# Altium schematic sheet EU_Esp32-S3-Mainboard.SchDoc
size A4; SheetNumber: 5; SheetTotal: 6
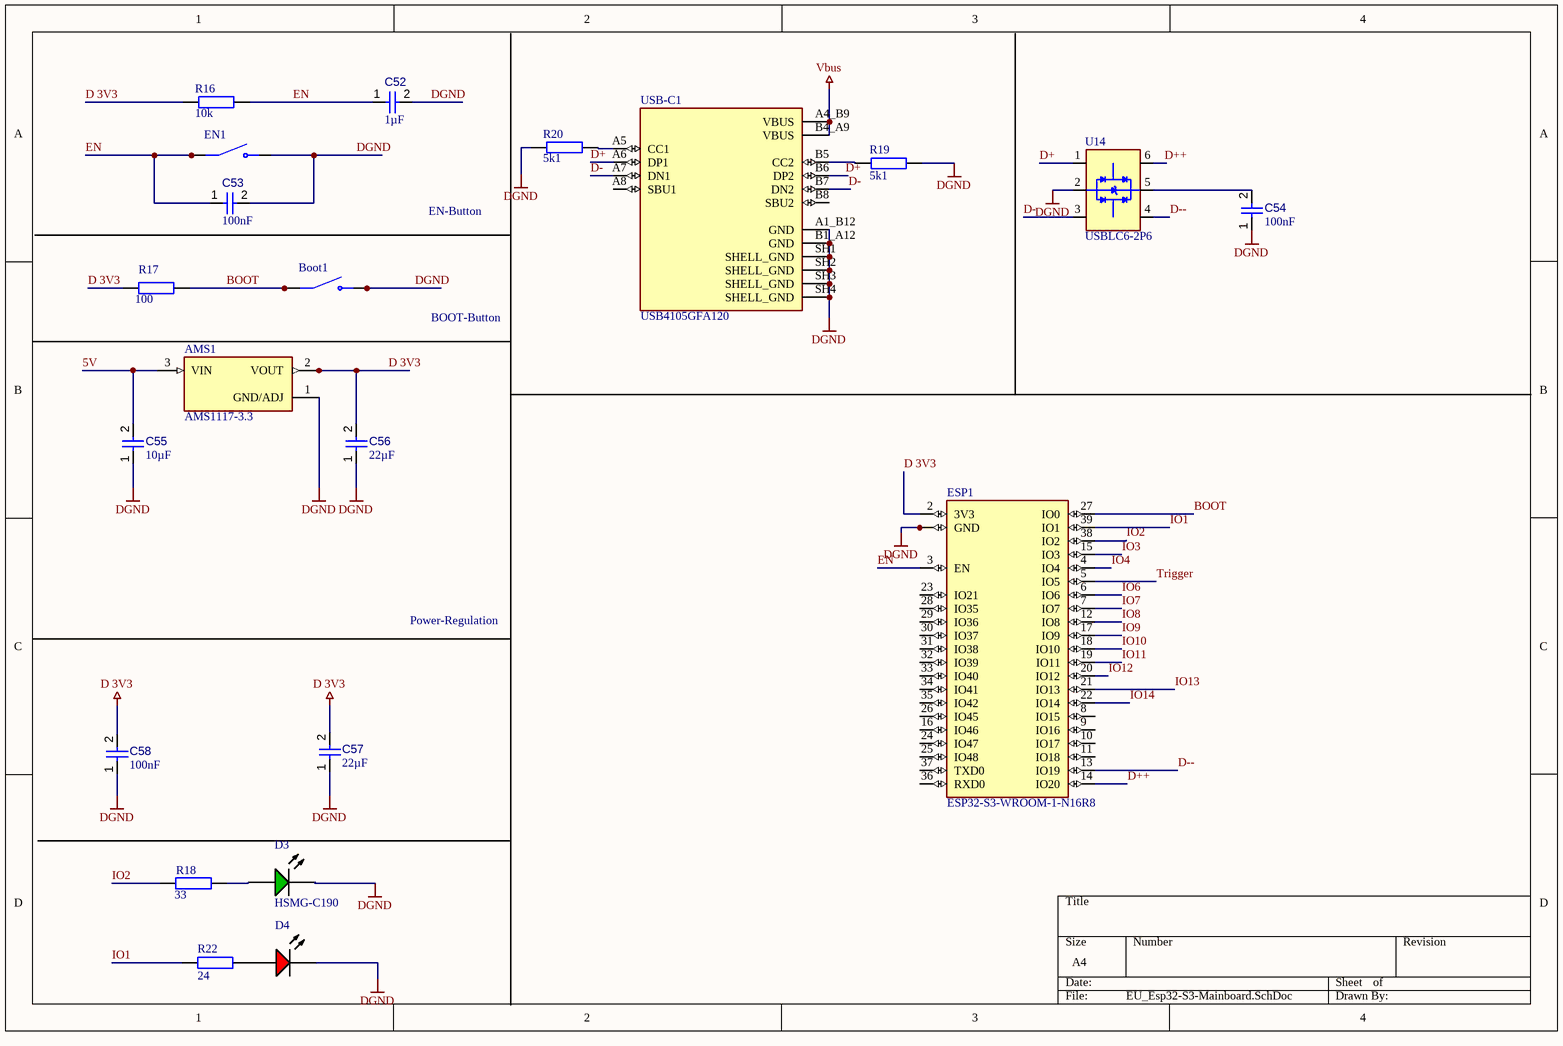
[diagram p0: EU_Esp32-S3-Mainboard.SchDoc]

## Parts
AMS1  AMS1117-3.3  [SOT229P700X180-4N]
Boot1  FSM2JSMLTR  [SW_1571527-2]  (value not drawn)
C52  value 1µF  [CAPC1608X90X35ML15T15]  (hidden comment: Capacitor 1uF +/- 10% 16V 0603)
C53  value 100nF  [CAPC1608X90X40NL10T20]  (hidden comment: Capacitor 100 nF +/-10% 50 V 0603)
C54  value 100nF  [CAPC0402(1005)60_L]  (hidden comment: Capacitor 100nF +/-20% 50V 0402)
C55  value 10µF  [CAPC0603(1608)100_L]  (hidden comment: Capacitor 10µF +/-20% 10V 0603)
C56  value 22µF  [CAPC0805(2012)145_L]  (hidden comment: Capacitor 22µF +/-40% 16V 0805)
C57  value 22µF  [CAPC0805(2012)145_L]  (hidden comment: Capacitor 22µF +/-40% 16V 0805)
C58  value 100nF  [CAPC1608X90X40NL10T20]  (hidden comment: Capacitor 100 nF +/-10% 50 V 0603)
D3  HSMG-C190  [AVAG-HSMX-C190_V]
D4  19-217/R6C-AL1M2VY/3T  [EVRL-0603-2_V]  (value not drawn)
EN1  FSM2JSMLTR  [SW_1571527-2]  (value not drawn)
ESP1  ESP32-S3-WROOM-1-N16R8  [ESP32S3WROOM1N8R2]
R16  value 10k  [Axial-0.4]  (hidden comment: RES)
R17  value 100  [Axial-0.4]  (hidden comment: RES)
R18  value 33  [Axial-0.4]  (hidden comment: RES)
R19  value 5k1  [Axial-0.4]  (hidden comment: RES)
R20  value 5k1  [Axial-0.4]  (hidden comment: RES)
R22  value 24  [Axial-0.4]  (hidden comment: RES)
U14  USBLC6-2P6  [SOT50P160X60-6N]
USB-C1  USB4105GFA120  [GCT_USB4105GFA120]

## Nets
D 3V3: AMS1.2(VOUT) C56.2 C57.2 C58.2 ESP1.2(3V3) R16.1 R17.1
DGND: AMS1.1(GND/ADJ) Boot1.3(NO) Boot1.4(NO) C52.2 C53.2 C54.1 C55.1 C56.1 C57.1 C58.1 D3.2(K) D4.2(K) EN1.3(NO) EN1.4(NO) ESP1.1(GND) ESP1.40(GND) ESP1.41(GND) ESP1.42(GND) ESP1.43(GND) ESP1.44(GND) ESP1.45(GND) ESP1.46(GND) ESP1.47(GND) ESP1.48(GND) ESP1.49(GND) R19.2 R20.1 U14.2(GND) USB-C1.A1_B12(GND) USB-C1.B1_A12(GND) USB-C1.SH1(SHELL_GND) USB-C1.SH2(SHELL_GND) USB-C1.SH3(SHELL_GND) USB-C1.SH4(SHELL_GND)
Vbus: USB-C1.A4_B9(VBUS) USB-C1.B4_A9(VBUS)
5V: AMS1.3(VIN) C55.2
BOOT: Boot1.1(COM) Boot1.2(COM) ESP1.27(IO0) R17.2
D+: U14.1(I/O1_1) USB-C1.A6(DP1) USB-C1.B6(DP2)
D++: ESP1.14(IO20) U14.6(I/O1_2)
D-: U14.3(I/O2_1) USB-C1.A7(DN1) USB-C1.B7(DN2)
D--: ESP1.13(IO19) U14.4(I/O2_2)
EN: C52.1 C53.1 EN1.1(COM) EN1.2(COM) ESP1.3(EN) R16.2
IO1: ESP1.39(IO1) R22.1
IO2: ESP1.38(IO2) R18.1
IO3: ESP1.15(IO3)
IO4: ESP1.4(IO4)
IO6: ESP1.6(IO6)
IO7: ESP1.7(IO7)
IO8: ESP1.12(IO8)
IO9: ESP1.17(IO9)
IO10: ESP1.18(IO10)
IO11: ESP1.19(IO11)
IO12: ESP1.20(IO12)
IO13: ESP1.21(IO13)
IO14: ESP1.22(IO14)
Trigger: ESP1.5(IO5)
NetC54_2: C54.2 U14.5(VBUS)
NetD3_1: D3.1(A) R18.2
NetD4_1: D4.1(A) R22.2
NetR19_1: R19.1 USB-C1.B5(CC2)
NetR20_2: R20.2 USB-C1.A5(CC1)

Not connected (* = marked no-connect by the designer): ESP1 8(IO15) 9(IO16) 10(IO17) 11(IO18) 16(IO46) 23(IO21) 24(IO47) 25(IO48) 26(IO45) 28(IO35) 29(IO36) 30(IO37) 31(IO38) 32(IO39) 33(IO40) 34(IO41) 35(IO42) 36(RXD0) 37(TXD0); USB-C1 A8(SBU1) B8(SBU2)

## Notes on the sheet
- EN-Button
- BOOT-Button
- Power-Regulation

## Library data of the parts
AMS1 = AMS1117-3.3: LDO Voltage Regulators 800MA LDO LINEAR REG; MF: ams AG; SnapEDA_Link: https://www.snapeda.com/parts/AMS1117-3.3/ams/view-part/?ref=snap; Package: SOT-223 Seeed Technology; Value: *; MP: AMS1117-3.3; Check_prices: https://www.snapeda.com/parts/AMS1117-3.3/ams/view-part/?ref=eda
Boot1 EN1 = CMP-016-000000-1: Switch Tactile OFF (ON) SPST Round Button Gull Wing 0.05A 24VDC 0.98N SMD T/R; MF: TE Connectivity; SnapEDA_Link: https://www.snapeda.com/parts/FSM2JSMLTR/TE+Connectivity+ALCOSWITCH+Switches/view-part/?ref=snap; Package: None; Check_prices: https://www.snapeda.com/parts/FSM2JSMLTR/TE+Connectivity+ALCOSWITCH+Switches/view-part/?ref=eda; Design Item ID: FSM2JSMLTR; Source: FSM2JSMLTR.SchLib; Value: *; MP: FSM2JSMLTR
C52 = CMP-001-00004-6: Chip Capacitor, 1 uF, +/- 10%, 16 V, 0603 (1608 Metric); Capacitor Type: Ceramic; Mounting Technology: SM; RoHS Compliant: True; Min Operating Temperature: -55°C; Case/Package: 0603; Pins: 2; Voltage Rating: 16V; Max Operating Temperature: 125°C; Tolerance: 10%
C53 C58 = CMP-001-00017-6: Chip Capacitor, 100 nF, +/- 10%, 50 V, 0603 (1608 Metric); Voltage Rating: 50V; Capacitor Type: Ceramic; Tolerance: 10%; Mounting Technology: SM; Max Operating Temperature: 125°C; RoHS Compliant: True; Pins: 2; Case/Package: 0603; Min Operating Temperature: -55°C
C54 = CMP-001-00067-3: Chip Capacitor, 100nF +/-20%, 50V, 0402, Thickness 0.6 mm; Tolerance: 10%; Min Operating Temperature: -55°C; Pins: 2; Case/Package: 0402; Max Operating Temperature: 85°C; Voltage Rating: 50V; Mounting Technology: SMT
C55 = CMP-001-00075-4: Chip Capacitor, 10µF +/-20%, 10V, 0603, Thickness 1 mm; Tolerance: 10%; Voltage Rating: 10V; Max Operating Temperature: 85°C; Pins: 2; Case/Package: 0603; Mounting Technology: SMT; Min Operating Temperature: -55°C
C56 C57 = CMP-001-00081-4: Chip Capacitor, 22µF +/-40%, 16V, 0805, Thickness 1.45 mm; Tolerance: 5%; Voltage Rating: 16V; Mounting Technology: SMT; Pins: 2; Max Operating Temperature: 85°C; Case/Package: 0805; Min Operating Temperature: -55°C
D3 = CMP-007-00013-2: LED Uni-Color Green, 52 mW, 20 mA, -40 to 85 degC, 2-Pin SMD, RoHS, Tape and Reel; Manufacturer: Avago; Forward Current: 20mA; Viewing Angle: 170degrees; Luminous Intensity: 15mcd; Lens Style: Diffused; Forward Voltage: 2.2V; Power: 52mW; Mounting Technology: SM; RoHS Compliant: True; Packaging: TapeandReel; Illumination Colour: Green; Datasheet URL: http://docs.avagotech.com/docs/AV02-0551EN; Min Operating Temperature: -40°C; Max Operating Temperature: 85°C; Pins: 2; Package Description: 2-Pin Surface Mount Device, Body 1.6 x 0.8 mm, Height 0.9 mm; Nominal Vf: 2.2V; Case/Package: 0603; Manufacturer URL: http://www.avagotech.com/; Datasheet Version: Mar-12; Colour: Green; Package Reference: HSMX-C190; Package Quantity: 4000
D4 = CMP-007-00004-2: Chip LED, Red, 5 V, 25 mA, -40 to 85 degC, 2-Pin SMD (0603), RoHS, Tape and Reel; Manufacturer: Everlight Electronics; Forward Voltage: 2.2V; Lens Style: Clear; Package Reference: 0603; Datasheet Version: Rev. 1, 01/2005; Mounting Technology: SM; RoHS Compliant: False; Datasheet URL: https://datasheet.ciiva.com/4688/el-19-217-r6c-al1m2vy-3tpdf-187026-4688713.pdf; Case/Package: 0603; Colour: Red; Manufacturer URL: http://www.everlight.com/; Package Description: 2-Pin Surface Mount Device, Body 1.6 x 0.8 mm
ESP1 = ESP32-S3-WROOM-1-N16R8: Bluetooth, WiFi 802.11b/g/n, Bluetooth v5.0 Transceiver Module 2.4GHz PCB Trace Surface Mount; MF: Espressif Systems; SnapEDA_Link: https://www.snapeda.com/parts/ESP32-S3-WROOM-1-N16R8/Espressif+Systems/view-part/?ref=snap; Package: NON STANDARD Espressif Systems; Value: *; MP: ESP32-S3-WROOM-1-N16R8; Check_prices: https://www.snapeda.com/parts/ESP32-S3-WROOM-1-N16R8/Espressif+Systems/view-part/?ref=eda
R16-R20 R22 = RES: Widerstand
U14 = USBLC6-2P6: 17V Clamp 5A (8/20Âµs) Ipp Tvs Diode Surface Mount SOT-666; MF: STMicroelectronics; SnapEDA_Link: https://www.snapeda.com/parts/USBLC6-2P6/STMicroelectronics/view-part/?ref=snap; Package: SOT-666 STMicroelectronics; Value: *; MP: USBLC6-2P6; Check_prices: https://www.snapeda.com/parts/USBLC6-2P6/STMicroelectronics/view-part/?ref=eda
USB-C1 = USB4105GFA120: USB CONN, 2.0 TYPE C, RCPT, 16POS, SMT; USB Connector Type:USB Type C; USB Standard:USB 2.0; Gender:Receptacle; No. of Positions:16Positions; Connector Mounting:Surface Mount, Through Hole Mount; Orientation:Right Angle RoHS Compliant: Yes; MF: Global Connector Technology; SnapEDA_Link: https://www.snapeda.com/parts/USB4105GFA120/Global+Connector+Technology/view-part/?ref=snap; Package: None; Value: *; MP: USB4105GFA120; Check_prices: https://www.snapeda.com/parts/USB4105GFA120/Global+Connector+Technology/view-part/?ref=eda